# Altium schematic sheet Revision History.SchDoc: Revision History
size Letter; Author: Alfredo Cortellini; Organization: IT Logic; Address1: 5753 Highway 85 N; Address2: Crestview, FL 32536; Address3: United States; DocumentNumber: 2; SheetNumber: 2; SheetTotal: 5; Email: pcb-design@itlogic.cloud
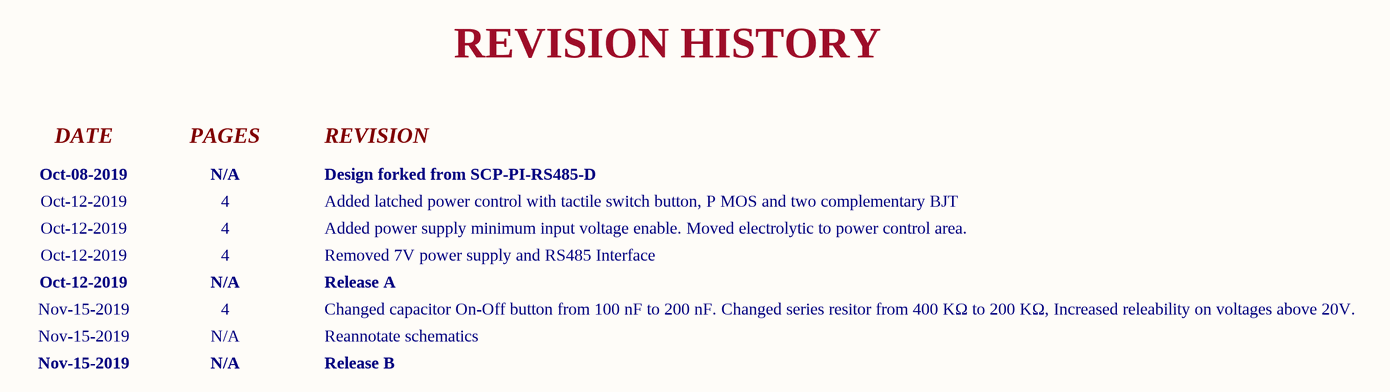
[diagram p0: Revision History.SchDoc]

## Notes on the sheet
- REVISION HISTORY
- DATE
- PAGES
- REVISION
- Oct-08-2019
- Oct-12-2019
- N/A
- 4
- Added latched power control with tactile switch button, P MOS and two complementary BJT
- Design forked from SCP-PI-RS485-D
- Removed 7V power supply and RS485 Interface
- Release A
- Added power supply minimum input voltage enable. Moved electrolytic to power control area.
- Nov-15-2019
- Reannotate schematics
- Changed capacitor On-Off button from 100 nF to 200 nF. Changed series resitor from 400 KΩ to 200 KΩ, Increased releability on voltages above 20V.
- Release B
- Project:
- Revision:
- Title:
- Sheet:
- of
- Author:
- Date:
- License:
- CC BY-NC-SA 4.0 <https://creativecommons.org/licenses/by-nc-sa/4.0/>